# Altium schematic sheet LAN.SchDoc
size A4
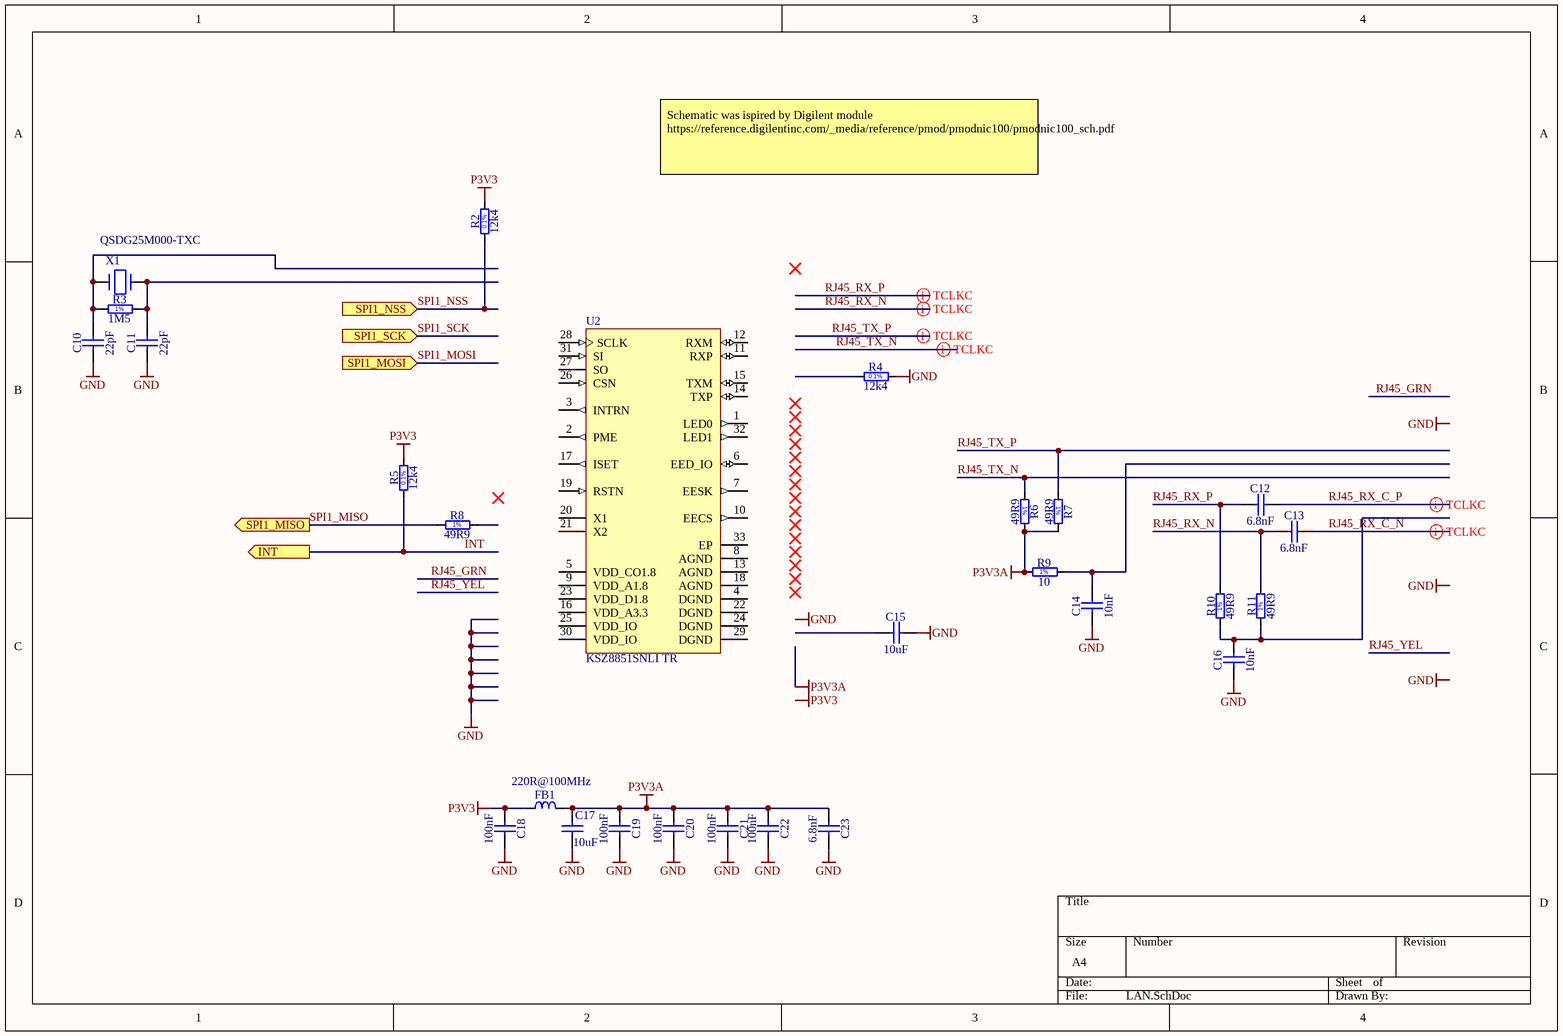
[diagram p0: LAN.SchDoc]

## Parts
C10  22pF  [CAPC1005X55N]
C11  22pF  [CAPC1005X55N]
C12  6.8nF  [CAPC1608X87N]
C13  6.8nF  [CAPC1608X87N]
C14  10nF  [CAPC1608X87N]
C15  10uF  [CAPC1608X80N]
C16  10nF  [CAPC1608X87N]
C17  10uF  [CAPC2012X135N]
C18  100nF  [CAPC1005X55N]
C19  100nF  [CAPC1005X55N]
C20  100nF  [CAPC1005X55N]
C21  100nF  [CAPC1005X55N]
C22  100nF  [CAPC1005X55N]
C23  6.8nF  [CAPC1608X87N]
FB1  220R@100MHz  [INDC2012X105N]
R2  12k4  [RESC1608X55N]
R3  1M5  [RESC1005X40N]
R4  12k4  [RESC1608X55N]
R5  12k4  [RESC1608X55N]
R6  49R9  [RESC1005X40N]
R7  49R9  [RESC1005X40N]
R8  49R9  [RESC1005X40N]
R9  10  [RESC1005X40N]
R10  49R9  [RESC1005X40N]
R11  49R9  [RESC1005X40N]
U2  KSZ8851SNLI TR  [MCHP-MLF-32_L]
X1  QSDG25M000-TXC  [XTAL_5.0*3.2]

## Ports
INT (out), SPI1_MISO (out), SPI1_MOSI (in), SPI1_NSS (in), SPI1_SCK (in)

## Nets
GND: C10.1 C11.1 C14.1 C15.2 C16.1 C17.2 C18.2 C19.2 C20.2 C21.2 C22.2 C23.2 R4.2
P3V3: C18.1 FB1.1 R2.2 R5.2
P3V3A: C17.1 C19.1 C20.1 C21.1 C22.1 C23.1 FB1.2 R6.2 R7.2 R9.1
INT: R5.1 ; port INT
RJ45_RX_C_N: C13.2
RJ45_RX_C_P: C12.2
RJ45_RX_N: C13.1 R11.2
RJ45_RX_P: C12.1 R10.2
RJ45_TX_N: R6.1
RJ45_TX_P: R7.1
SPI1_MISO: R8.1 ; port SPI1_MISO
SPI1_MOSI: port SPI1_MOSI
SPI1_NSS: R2.1 ; port SPI1_NSS
SPI1_SCK: port SPI1_SCK
NetC10_2: C10.2 R3.1 X1.1
NetC11_2: C11.2 R3.2 X1.2
NetC14_2: C14.2 R9.2
NetC16_2: C16.2 R10.1 R11.1

Not connected (* = marked no-connect by the designer): C15 1; R4 1; R8 2; U2 1(LED0) 2(PME) 3(INTRN) 4(DGND) 5(VDD_CO1.8) 6(EED_IO) 7(EESK) 8(AGND) 9(VDD_A1.8) 10(EECS) 11(RXP) 12(RXM) 13(AGND) 14(TXP) 15(TXM) 16(VDD_A3.3) 17(ISET) 18(AGND) 19(RSTN) 20(X1) 21(X2) 22(DGND) 23(VDD_D1.8) 24(DGND) 25(VDD_IO) 26(CSN) 27(SO) 28(SCLK) 29(DGND) 30(VDD_IO) 31(SI) 32(LED1) 33(EP)

## Layout directives
differential pair: RJ45_RX_C_N, RJ45_RX_C_P, RJ45_RX_N, RJ45_RX_P, RJ45_TX_N, RJ45_TX_P

## Notes on the sheet
- Schematic was ispired by Digilent module https://reference.digilentinc.com/_media/reference/pmod/pmodnic100/pmodnic100_sch.pdf
- Labels drawn without touching a wire or pin: GND, P3V3
- (in symbol R0402_1M5_1%_0.0625W_100PPM) 1%
- (in symbol R0402_10R_1%_0.0625W_200PPM) 1%
- (in symbol R0402_49R9_1%_0.0625W_100PPM) 1%
- (in symbol R0603_12K4_0.1%_0.063W_10PPM) 0.1%

## Library data of the parts
C10 C11 = CC0402_22PF_50V_5%_NP0: Non-polarised capacitor; Part Description: SMD Multilayer Chip Ceramic Capacitor; Manufacturer: GENERIC; Manufacturer1 Part Number: 223886915229; Voltage: 50V; TC: NP0; Tolerance: ±5%; Table: Capacitors SMD; Part Number: CC0402_22PF_50V_5%_NP0; Component Kind: Standard; Component Type: Standard; Pin Count: 2; Value: 22pF; Status: Not Recommended; Manufacturer Part Number: CC0402_22PF_50V_5%_NP0; Case: 0402; Mounted: Yes; Socket: No; SMD: Yes; Manufacturer1 Example: PHYCOMP; Manufacturer1 ComponentHeight: 0.55mm; HelpURL: \\cern.ch\dfs\Applications\Altium\Datasheets\CC0402_NP0_PHYCOMP.pdf; Author: CERN DEM JLC; CreateDate: 2007-12-03; LatestRevisionDate: 2007-12-03
C12 C13 C23 = CC0603_6.8NF_25V_1%_C0G: Non-polarised capacitor; Part Description: SMD Multilayer Chip Ceramic Capacitor; Manufacturer: GENERIC; Manufacturer1 Part Number: C0603C682F3GACTU; Voltage: 25V; TC: C0G/NP0; Tolerance: ±1%; Part Number: CC0603_6.8NF_25V_1%_C0G; Component Kind: Standard; Component Type: Standard; Pin Count: 2; Value: 6.8nF; Status: None; Manufacturer Part Number: CC0603_6.8NF_25V_1%_C0G; Case: 0603; Mounted: Yes; Socket: No; SMD: Yes; Sense: No; Manufacturer1 Example: KEMET; Manufacturer1 ComponentHeight: 0.87mm; HelpURL: \\cern.ch\dfs\Applications\Altium\Datasheets\CC0603_C0G_KEMET_(Commercial Grade).pdf; Author: CERN DEM JLC; CreateDate: 23/05/2018; LatestRevisionDate: 23/05/2018
C14 C16 = CC0603_10NF_50V_5%_C0G: Non-polarised capacitor; Part Description: SMD Multilayer Chip Ceramic Capacitor; Manufacturer: GENERIC; Manufacturer1 Part Number: C1608C0G1H103J080AA; Voltage: 50V; TC: C0G/NP0; Tolerance: ±5%; Part Number: CC0603_10NF_50V_5%_C0G; Component Kind: Standard; Component Type: Standard; Pin Count: 2; Value: 10nF; Status: Preferred; Manufacturer Part Number: CC0603_10NF_50V_5%_C0G; Case: 0603; Mounted: Yes; Socket: No; SMD: Yes; Sense: No; Manufacturer1 Example: TDK; Manufacturer1 ComponentHeight: 0.9mm; HelpURL: \\cern.ch\dfs\Applications\Altium\Datasheets\CC0603_C0G_TDK_C.pdf; Author: CERN DEM JLC; CreateDate: 10.12.2014; LatestRevisionDate: 10.12.2014
C15 = CC0603_10UF_16V_20%_X5R: Non-polarised capacitor; Part Description: SMD Multilayer Chip Ceramic Capacitor; Manufacturer: GENERIC; Manufacturer1 Part Number: GRM188R61C106MA73D; Voltage: 16V; TC: X5R; Tolerance: ±20%; Part Number: CC0603_10UF_16V_20%_X5R; Component Kind: Standard; Component Type: Standard; Pin Count: 2; Value: 10uF; Status: None; Manufacturer Part Number: CC0603_10UF_16V_20%_X5R; Case: 0603; Mounted: Yes; Socket: No; SMD: Yes; Sense: No; Manufacturer1 Example: MURATA; Manufacturer1 ComponentHeight: 0.8mm; HelpURL: \\cern.ch\dfs\Applications\Altium\Datasheets\CC0603_X5R_MURATA_GRM.pdf; Author: CERN DEM MR; CreateDate: 02/03/2016; LatestRevisionDate: 02/03/2016
C17 = CC0805_10UF_10V_10%_X7R: Non-polarised capacitor; Part Description: SMD Multilayer Chip Ceramic Capacitor; Manufacturer: GENERIC; Manufacturer1 Part Number: GRM21BR71A106KE51L; Voltage: 10V; TC: X7R; Tolerance: ±10%; Table: Capacitors SMD; Part Number: CC0805_10UF_10V_10%_X7R; Component Kind: Standard; Component Type: Standard; Pin Count: 2; Value: 10uF; Status: Preferred; Manufacturer Part Number: CC0805_10UF_10V_10%_X7R; Case: 0805; Mounted: Yes; Socket: No; SMD: Yes; Manufacturer1 Example: MURATA; Manufacturer1 ComponentHeight: 1.35mm; HelpURL: \\cern.ch\dfs\Applications\Altium\Datasheets\CC0805_X7R_MURATA.pdf; Author: CERN DEM JLC; CreateDate: 2012-04-30; LatestRevisionDate: 2012-04-30
C18-C22 = CC0402_100NF_16V_10%_X7R: Non-polarised capacitor; Part Description: SMD Multilayer Chip Ceramic Capacitor; Manufacturer: GENERIC; Manufacturer1 Part Number: GRM155R71C104KA88D; Voltage: 16V; TC: X7R; Tolerance: ±10%; Part Number: CC0402_100NF_16V_10%_X7R; Component Kind: Standard; Component Type: Standard; Pin Count: 2; Value: 100nF; Status: Not Recommended; Manufacturer Part Number: CC0402_100NF_16V_10%_X7R; Case: 0402; Mounted: Yes; Socket: No; SMD: Yes; Manufacturer1 Example: MURATA; Manufacturer1 ComponentHeight: 0.55mm; HelpURL: \\cern.ch\dfs\Applications\Altium\Datasheets\CC0402_X7R_MURATA_GRM.pdf; Author: CERN DEM JLC; CreateDate: 05.12.2013; LatestRevisionDate: 03.12.2007; Sense: No
FB1 = IND0805_MURATA_BLM21PG221SN1D: Inductor; Part Description: SMD EMIFIL Suppression Chip Ferrite Bead; Manufacturer: MURATA; Power: 2A; Resistance: 0.05R; Tolerance: ±25%; Table: Inductors SMD; Part Number: IND0805_MURATA_BLM21PG221SN1D; Component Kind: Standard; Component Type: Standard; Pin Count: 2; Value: 220R@100MHz; Status: None; Manufacturer Part Number: BLM21PG221SN1D; Case: 0805; Mounted: Yes; Socket: No; SMD: Yes; ComponentHeight: 1.05mm; HelpURL: \\cern.ch\dfs\Applications\Altium\Datasheets\IND0402_MURATA_BLM21P.pdf; Author: CERN DEM JLC; CreateDate: 2010-01-25; LatestRevisionDate: 2010-01-25
R2 R4 R5 = R0603_12K4_0.1%_0.063W_10PPM: Resistor - 0.1%; Part Description: Thin Film Chip Resistor; Manufacturer: GENERIC; Manufacturer1 Part Number: RN73C1J12K4BTDF; Power: 0.063W; TC: ±10ppm; Part Number: R0603_12K4_0.1%_0.063W_10PPM; Component Kind: Standard; Component Type: Standard; Pin Count: 2; Value: 12k4; Status: Not recommended; Tolerance: ±0.1%; Manufacturer Part Number: R0603_12K4_0.1%_0.063W_10PPM; Case: 0603; Mounted: Yes; Sense: No; Socket: No; SMD: Yes; Manufacturer1 Example: TYCO HOLSWORTHY; Manufacturer1 ComponentHeight: 0.5mm; HelpURL: \\cern.ch\dfs\Applications\Altium\Datasheets\R0603_Tyco_RN73.pdf; Author: CERN DEM JLC; CreateDate: 03.12.2007; LatestRevisionDate: 13.03.2008
R3 = R0402_1M5_1%_0.0625W_100PPM: Resistor - 1%; Part Description: General Purpose Thick Film Chip Resistor; Manufacturer: GENERIC; Manufacturer1 Part Number: 232270671505L; TC: ±100ppm/°C; PressFit: No; Part Number: R0402_1M5_1%_0.0625W_100PPM; Component Kind: Standard; Component Type: Standard; Pin Count: 2; Value: 1M5; Status: Not Recommended; Power: 0.0625W; Tolerance: ±1%; Manufacturer Part Number: R0402_1M5_1%_0.0625W_100PPM; Case: 0402; Mounted: Yes; Sense: No; Socket: No; SMD: Yes; Manufacturer1 Example: YAGEO PHYCOMP; Manufacturer1 ComponentHeight: 0.4mm; HelpURL: \\cern.ch\dfs\Applications\Altium\Datasheets\R0402_Phycomp_RC0402.pdf; Author: CERN DEM JLC; CreateDate: 03/12/2007; LatestRevisionDate: 17/10/2012
R6-R8 R10 R11 = R0402_49R9_1%_0.0625W_100PPM: Resistor - 1%; Part Description: General Purpose Thick Film Chip Resistor; Manufacturer: GENERIC; Manufacturer1 Part Number: 232270674999L or RC0402FR-0749R9L; TC: ±100ppm/°C; Table: Resistors SMD; Part Number: R0402_49R9_1%_0.0625W_100PPM; Component Kind: Standard; Component Type: Standard; Pin Count: 2; Value: 49R9; Status: Not recommended; Power: 0.0625W; Tolerance: ±1%; Manufacturer Part Number: R0402_49R9_1%_0.0625W_100PPM; Case: 0402; Mounted: Yes; Socket: No; SMD: Yes; Manufacturer1 Example: YAGEO PHYCOMP; Manufacturer1 ComponentHeight: 0.4mm; HelpURL: \\cern.ch\dfs\Applications\Altium\Datasheets\R0402_Phycomp_RC0402.pdf; Author: CERN DEM JLC; CreateDate: 2012-10-24; LatestRevisionDate: 2012-10-24
R9 = R0402_10R_1%_0.0625W_200PPM: Resistor - 1%; Part Description: General Purpose Thick Film Chip Resistor; Manufacturer: GENERIC; Manufacturer1 Part Number: 232270671009L; TC: ±200ppm/°C; Part Number: R0402_10R_1%_0.0625W_200PPM; Component Kind: Standard; Component Type: Standard; Pin Count: 2; Value: 10; Status: Not recommended; Power: 0.0625W; Tolerance: ±1%; Manufacturer Part Number: R0402_10R_1%_0.0625W_200PPM; Case: 0402; Mounted: Yes; Sense: No; Socket: No; SMD: Yes; Manufacturer1 Example: YAGEO PHYCOMP; Manufacturer1 ComponentHeight: 0.4mm; HelpURL: \\cern.ch\dfs\Applications\Altium\Datasheets\R0402_Phycomp_RC0402.pdf; Author: CERN DEM JLC; CreateDate: 24.06.2009; LatestRevisionDate: 17.10.2012
U2 = CMP-2000-06522-1: Single-Port Ethernet Controller with SPI Interface, 3.1 to 3.5 V, -40 to 85 degC, 32-Pin MLF, RoHS, Tape and Reel; Manufacturer: Micrel; Protocol Supported: 802.3; Number of Transceivers: 1Transceiver; Data Rate: 100Mbps; Maximum Supply Current: 85mA; Supply Voltage - Min: 3.1V; Ethernet Connection Type: 10/100Base-TX; Supply Voltage - Max: 3.5V; Package Description: 32-Pin Quad Flat No-lead Package, Body 5 x 5 mm, Thermal Pad 3.1 x 3.1 mm, Pitch 0.5 mm; Mounting Style: SMD/SMT; Series: KSZ8851; Manufacturer URL: http://www.microchip.com/; Minimum Operating Temperature: -40C; Packaging: Reel; Package Reference: MLF-32; Package / Case: MLF-32; Datasheet Version: 11/2016; Mounting Technology: SurfaceMount; Datasheet URL: http://ww1.microchip.com/downloads/en/DeviceDoc/00002381A.pdf; Product Category: EthernetICs; Maximum Operating Temperature: +85C; Product: EthernetControllers; RoHS: Details; Brand: Micrel; Factory Pack Quantity: 1000
X1 = X_CRYSTAL_SMD_5.0*3.2: miniature crystal oscillator (Maritex)